# EAGLE design usbswitch_transistor1 (EAGLE 6.2)
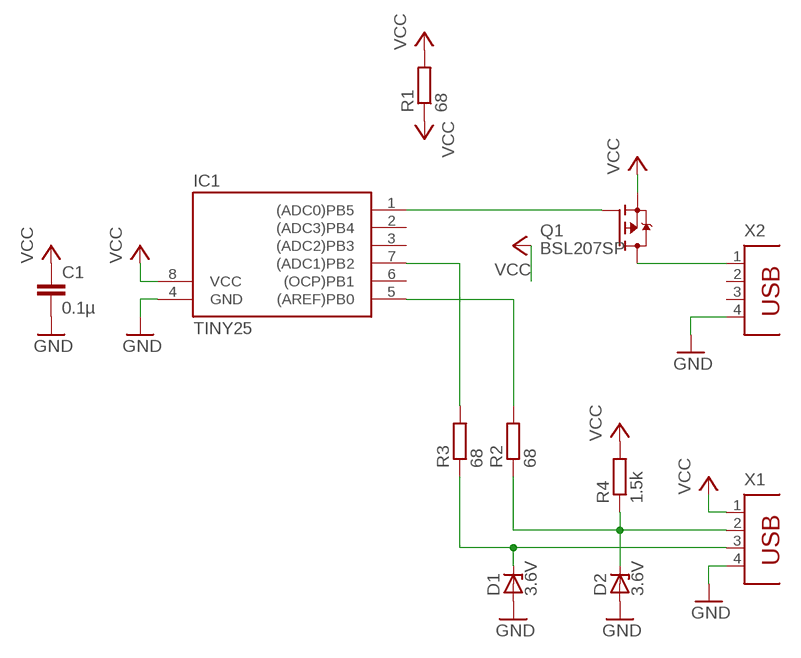
[diagram p0: schematic, sheet 1]

## Parts
C1  0.1µ  C-EUC1206  [C1206]
D1  3.6V  ZENER-DIODESOD80C  [SOD80C]
D2  3.6V  ZENER-DIODESOD80C  [SOD80C]
IC1  TINY25  TINY15LS  [SOIC8]
Q1  BSL207SP  [SOT23]
R1  68  R-EU_R1206  [R1206]
R2  68  R-EU_R0805  [R0805]
R3  68  R-EU_R0805  [R0805]
R4  1.5k  R-EU_R0805  [R0805]
X1  PN87520  [PN87520]
X2  PN87520  [PN87520]

## Nets
GND: C1.2 D1.A D2.A IC1.4(GND) X1.4 X2.4
N$1: IC1.1((ADC0)PB5) Q1.1(G)
N$2: Q1.3(D) X2.1
N$4: D2.C R2.1 R4.1 X1.2
N$5: D1.C R3.1 X1.3
N$6: IC1.5((AREF)PB0) R2.2
N$7: IC1.7((ADC1)PB2) R3.2
VCC: C1.1 IC1.8(VCC) Q1.2(S) R1.1 R1.2 R4.2 X1.1
Unconnected: IC1.2((ADC3)PB4) IC1.3((ADC2)PB3) IC1.6((OCP)PB1) X2.2 X2.3

## Library data of the parts
C1 = resistor:C-EU: CAPACITOR, European symbol
D1 D2 = diode:ZENER-DIODE: Z-Diode
IC1 = atmel:TINY15L: MICROCONTROLLER 2.7 V 1 Kbytes FLASH 64 bytes EEPROM 4-channel 10 bit ADC; OC_FARNELL: unknown; OC_NEWARK: unknown
Q1 = irf:BSL207SP: OptiMOS(R)-P Small-Signal-Transistor P-Channel, Enhancement mode, Super Logic Level (2.5 V rated) Source: http://www.infineon.com/upload/Document/BSL207SP_Rev2.01.pdf
R1-R4 = resistor:R-EU_: RESISTOR, European symbol
X1 X2 = con-berg:PN87520: BERG USB connector; OC_FARNELL: unknown; OC_NEWARK: unknown

## Board
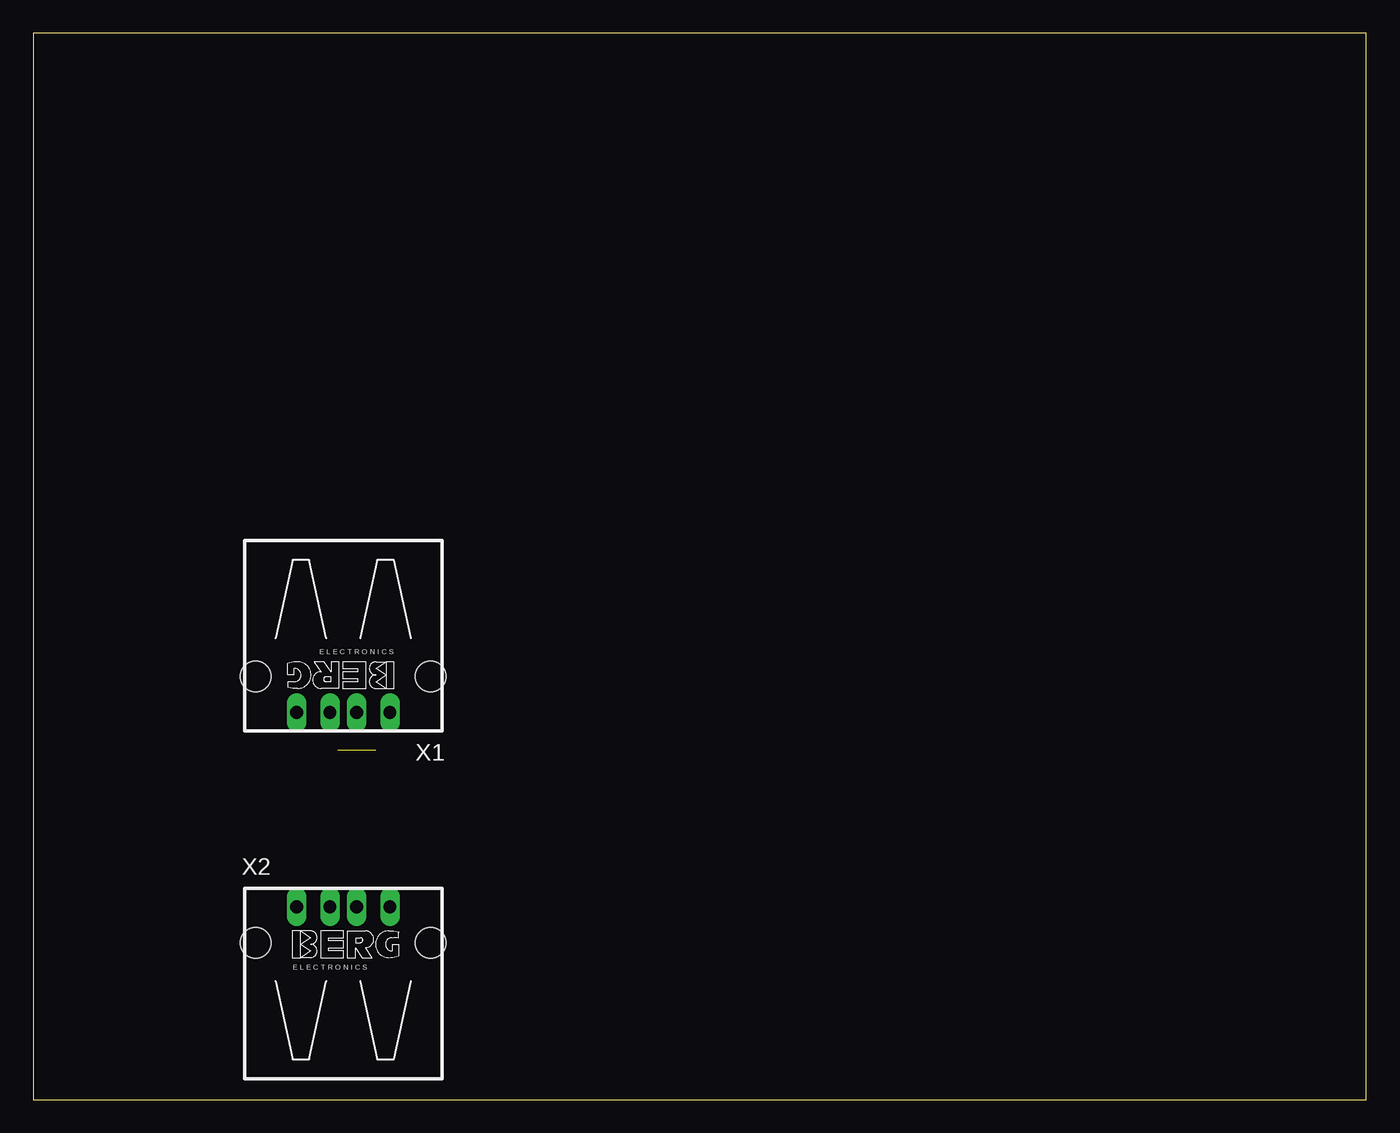
[diagram p1: board, top side]
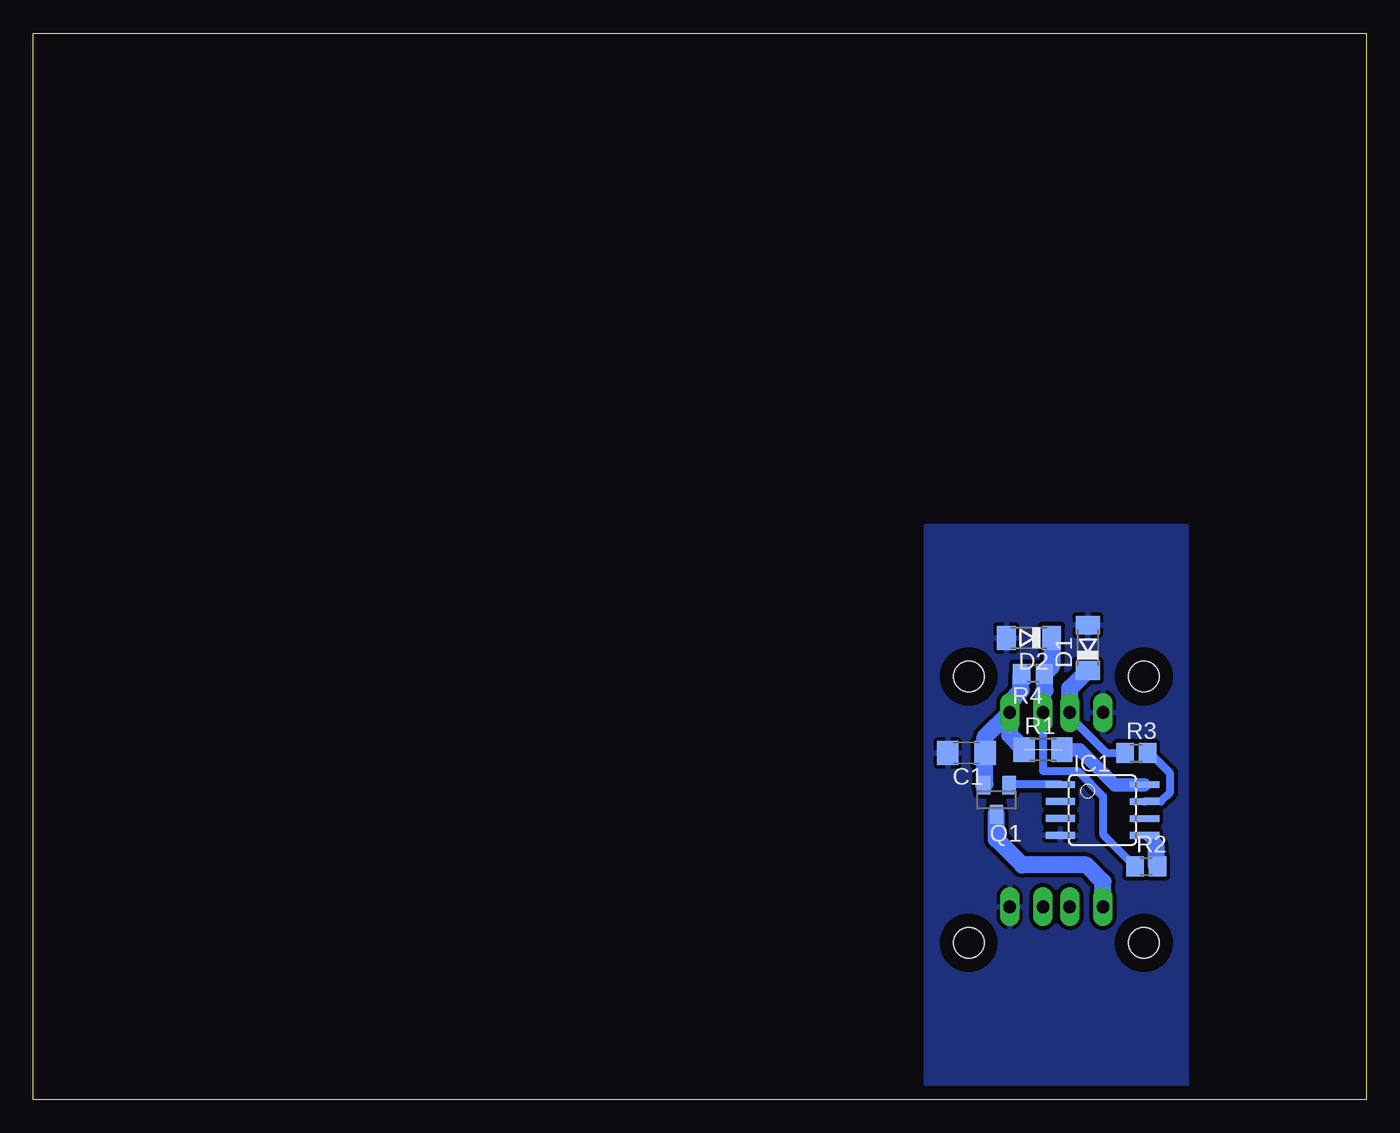
[diagram p2: board, bottom side, seen from below]

Size 100 x 80 mm. Coordinates in mm from the lower left corner, seen from the top.
Outline: 0,0 100,0 100,80 0,80 0,0
Copper layers (1*16): Top 0.035mm / dielectric 1.5mm / Bottom 0.035mm
Design rules: minimum track width 12mil, minimum drill 10mil, track to track 12mil, track to pad 12mil, pad to pad 12mil, via to via 12mil, smd to smd 12mil, copper to edge 40mil, drill to drill 12mil, minimum pad ring 10mil, minimum via ring 8mil, stop-mask expansion 4mil, vias tented up to drill 0mil, thermal gap 10mil

### Footprints (pad centres in the part's own frame; a part is rotated, then mirrored left to right if it is on the bottom)
C1206 = smd 1.6 x 1.8: 1 -1.4,0; 2 1.4,0
SOD80C = smd 1.4 x 1.8: A 1.7,0; C -1.7,0
SOIC8 = smd 0.5 x 2.2: 1 -1.905,-3.154; 2 -0.645,-3.154; 3 0.625,-3.154; 4 1.895,-3.154; 5 1.905,3.154; 6 0.635,3.154; 7 -0.635,3.154; 8 -1.905,3.154
SOT23 = smd 1 x 1.4: 1 -0.95,-1.1; 2 0.95,-1.1; 3 0,1.1
R1206 = smd 1.6 x 1.803: 1 -1.422,0; 2 1.422,0
R0805 = smd 1.3 x 1.5: 1 -0.85,0; 2 0.85,0
PN87520 = drill 0.95 long: 1 -3.5,2.71; 2 -1,2.71; 3 1,2.71; 4 3.5,2.71 | hole 2.3: -6.57,0; 6.57,0

### Placement (x,y rotation side)
C1  30,26 180 bottom
D1  20.9,33.9 90 bottom
D2  25.3,34.65 180 bottom
IC1  19.79,21.72 270 bottom
Q1  27.75,22.5 180 bottom
R1  24.25,26.25 0 bottom
R2  16.5,17.5 0 bottom
R3  17.25,26 0 bottom
R4  25,31.95 180 bottom
X1  23.25,31.75 180 top
X2  23.25,11.75 0 top

### Tracks (layer width: path | path; a pad name or v marks a point on that pad's centre or on a via)
GND
  pour Bottom: 13.5,1 33,1 33,43 13.5,43
N$1
  Bottom 0.406: IC1.1 22.97,23.66 | 26.25,23.66 Q1.1
  Bottom 0.61: 22.97,23.66 26.25,23.66
N$2
  Bottom 1.27: X2.1 19.75,16.35 21,17.6 25.8,17.6 27.75,19.55 Q1.3
N$4
  Bottom 0.61: X1.2 24.25,24.65 21.65,24.65 19.75,22.75 19.75,19.9 R2.1
  Bottom 1.27: D2.C 23.6,32.5 R4.1 24.1,31.9 24.1,30.7 24.25,30.55 X1.2
N$5
  Bottom 0.61: X1.3 22.25,28.75 19.5,26 R3.1
  Bottom 1.27: X1.3 22.25,30.85 D1.C
N$6
  Bottom 0.406: R2.2 15.75,17.6 | 16.57,19.82 IC1.5
  Bottom 0.61: 15.75,19 16.57,19.82
  Bottom 1.27: 15.75,17.6 15.75,19
N$7
  Bottom 0.406: R3.2 16.25,26
  Bottom 0.61: 16.25,26 14.75,24.5 14.75,23 15.39,22.36 IC1.7
VCC  (1 unrouted)
  Bottom 1.016: IC1.8 18.88,23.62 21.5,26.25 R1.2
  Bottom 1.27: X1.1 28.6,27.19 C1.1 28.6,23.7 Q1.2 | R1.1 26.75,27.33 X1.1 | X1.1 26.75,29.85 25.9,30.7 25.9,31.9 R4.2